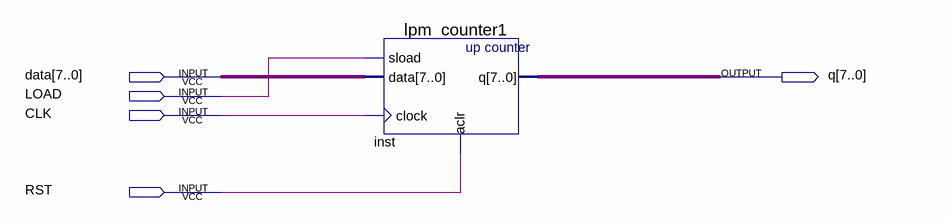
[diagram p0: schematic sheet]
// Quartus schematic Counter.bdf as structural Verilog: 1 symbols, 5 pins
module Counter (
  input  [7:0] data,
  input  LOAD,
  input  CLK,
  input  RST,
  output [7:0] q
);

  lpm_counter1 inst (.sload(LOAD), .data(data), .clock(CLK), .aclr(RST), .q(q));
endmodule
